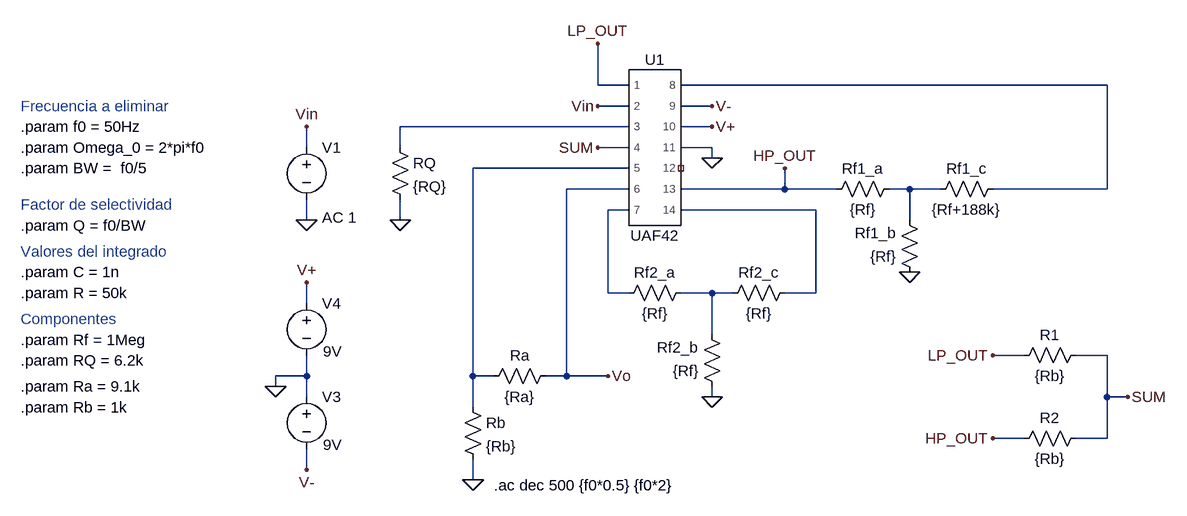
[diagram p0: schematic Notch_uaf42.asc]
Notch_uaf42.asc, the LTspice schematic file:
Version 4
SHEET 1 1068 892
WIRE 80 48 80 -16
WIRE 128 48 80 48
WIRE 864 48 208 48
WIRE 128 80 80 80
WIRE 256 80 208 80
WIRE 128 112 -224 112
WIRE 256 112 208 112
WIRE -368 144 -368 112
WIRE -224 144 -224 112
WIRE 128 144 80 144
WIRE 256 144 208 144
WIRE 256 160 256 144
WIRE 128 176 -112 176
WIRE 128 208 32 208
WIRE 368 208 368 176
WIRE 368 208 208 208
WIRE 448 208 368 208
WIRE 560 208 528 208
WIRE 608 208 560 208
WIRE 864 208 864 48
WIRE 864 208 688 208
WIRE 128 240 96 240
WIRE 416 240 208 240
WIRE -368 256 -368 224
WIRE -224 256 -224 224
WIRE 560 256 560 208
WIRE 96 368 96 240
WIRE 128 368 96 368
WIRE 256 368 208 368
WIRE 288 368 256 368
WIRE 416 368 416 240
WIRE 416 368 368 368
WIRE -368 384 -368 352
WIRE 256 432 256 368
WIRE 736 464 688 464
WIRE 864 464 816 464
WIRE -368 496 -368 464
WIRE -368 496 -416 496
WIRE -112 496 -112 176
WIRE -80 496 -112 496
WIRE 32 496 32 208
WIRE 32 496 0 496
WIRE 96 496 32 496
WIRE -416 512 -416 496
WIRE -368 528 -368 496
WIRE 256 528 256 512
WIRE 864 528 864 464
WIRE 896 528 864 528
WIRE -112 544 -112 496
WIRE 736 592 688 592
WIRE 864 592 864 528
WIRE 864 592 816 592
WIRE -368 640 -368 608
WIRE -112 656 -112 624
FLAG -368 256 0
FLAG 256 160 0
FLAG 80 -16 LP_OUT
FLAG 368 176 HP_OUT
FLAG 256 112 V+
FLAG 256 80 V-
FLAG 96 496 Vo
FLAG -112 656 0
FLAG 80 144 SUM
FLAG 80 80 Vin
FLAG -368 112 Vin
FLAG -416 512 0
FLAG -368 352 V+
FLAG -368 640 V-
FLAG -224 256 0
FLAG 896 528 SUM
FLAG 688 464 LP_OUT
FLAG 688 592 HP_OUT
FLAG 256 528 0
FLAG 560 336 0
SYMBOL AutoGenerated\\UAF42 160 144 R0
SYMATTR InstName U1
SYMBOL voltage -368 128 R0
WINDOW 123 24 124 Left 2
WINDOW 39 0 0 Left 0
SYMATTR Value2 AC 1
SYMATTR InstName V1
SYMATTR Value ""
SYMBOL res -240 128 R0
SYMATTR InstName RQ
SYMATTR Value {RQ}
SYMBOL res 224 352 R90
WINDOW 0 0 56 VBottom 2
WINDOW 3 32 56 VTop 2
SYMATTR InstName Rf2_a
SYMATTR Value {Rf}
SYMBOL res 16 480 R90
WINDOW 0 0 56 VBottom 2
WINDOW 3 32 56 VTop 2
SYMATTR InstName Ra
SYMATTR Value {Ra}
SYMBOL res -128 528 R0
SYMATTR InstName Rb
SYMATTR Value {Rb}
SYMBOL voltage -368 512 R0
WINDOW 3 25 90 Left 2
WINDOW 123 24 124 Left 2
WINDOW 39 0 0 Left 0
SYMATTR Value 9V
SYMATTR InstName V3
SYMBOL voltage -368 368 R0
WINDOW 3 25 90 Left 2
WINDOW 123 24 124 Left 2
WINDOW 39 0 0 Left 0
SYMATTR Value 9V
SYMATTR InstName V4
SYMBOL res 832 448 R90
WINDOW 0 0 56 VBottom 2
WINDOW 3 32 56 VTop 2
SYMATTR InstName R1
SYMATTR Value {Rb}
SYMBOL res 832 576 R90
WINDOW 0 0 56 VBottom 2
WINDOW 3 32 56 VTop 2
SYMATTR InstName R2
SYMATTR Value {Rb}
SYMBOL res 384 352 R90
WINDOW 0 0 56 VBottom 2
WINDOW 3 32 56 VTop 2
SYMATTR InstName Rf2_c
SYMATTR Value {Rf}
SYMBOL res 272 528 R180
WINDOW 0 36 76 Left 2
WINDOW 3 36 40 Left 2
SYMATTR InstName Rf2_b
SYMATTR Value {Rf}
SYMBOL res 544 192 R90
WINDOW 0 0 56 VBottom 2
WINDOW 3 32 56 VTop 2
SYMATTR InstName Rf1_a
SYMATTR Value {Rf}
SYMBOL res 704 192 R90
WINDOW 0 0 56 VBottom 2
WINDOW 3 32 56 VTop 2
SYMATTR InstName Rf1_c
SYMATTR Value {Rf+188k}
SYMBOL res 576 352 R180
WINDOW 0 36 76 Left 2
WINDOW 3 36 40 Left 2
SYMATTR InstName Rf1_b
SYMATTR Value {Rf}
TEXT -808 440 Left 2 !.param Rf = 1Meg
TEXT -808 112 Left 2 !.param f0 = 50Hz
TEXT -808 80 Left 2 ;Frecuencia a eliminar
TEXT -808 144 Left 2 !.param Omega_0 = 2*pi*f0
TEXT -808 336 Left 2 !.param C = 1n
TEXT -808 304 Left 2 ;Valores del integrado
TEXT -808 408 Left 2 ;Componentes
TEXT -808 472 Left 2 !.param RQ = 6.2k
TEXT -808 232 Left 2 ;Factor de selectividad
TEXT -808 264 Left 2 !.param Q = f0/BW
TEXT -808 176 Left 2 !.param BW =  f0/5
TEXT -808 368 Left 2 !.param R = 50k
TEXT -808 512 Left 2 !.param Ra = 9.1k
TEXT -808 544 Left 2 !.param Rb = 1k
TEXT -80 664 Left 2 !.ac dec 500 {f0*0.5} {f0*2}

The netlist it stands for:
* Notch_uaf42.asc
XU1 LP_OUT Vin N002 SUM N003 Vo N005 N001 V- V+ 0 NC_01 HP_OUT N006 UAF42  ; pins 1 2 3 4 5 6 7 8 9 10 11 12 13 14
V1 Vin 0 AC 1
RQ N002 0 {RQ}
Rf2_a N007 N005 {Rf}
Ra Vo N003 {Ra}
Rb N003 0 {Rb}
V3 0 V- 9V
V4 V+ 0 9V
R1 SUM LP_OUT {Rb}
R2 SUM HP_OUT {Rb}
Rf2_c N006 N007 {Rf}
Rf2_b 0 N007 {Rf}
Rf1_a N004 HP_OUT {Rf}
Rf1_c N001 N004 {Rf+188k}
Rf1_b 0 N004 {Rf}
.param Rf = 1Meg
.param f0 = 50Hz
* Frecuencia a eliminar
.param Omega_0 = 2*pi*f0
.param C = 1n
* Valores del integrado
* Componentes
.param RQ = 6.2k
* Factor de selectividad
.param Q = f0/BW
.param BW =  f0/5
.param R = 50k
.param Ra = 9.1k
.param Rb = 1k
.ac dec 500 {f0*0.5} {f0*2}
.lib "C:\Users\marti\AppData\Local\LTspice\lib\sub\UAF42.lib"
.backanno
.end